# EAGLE design PocketKerbal (EAGLE 9.6.2)
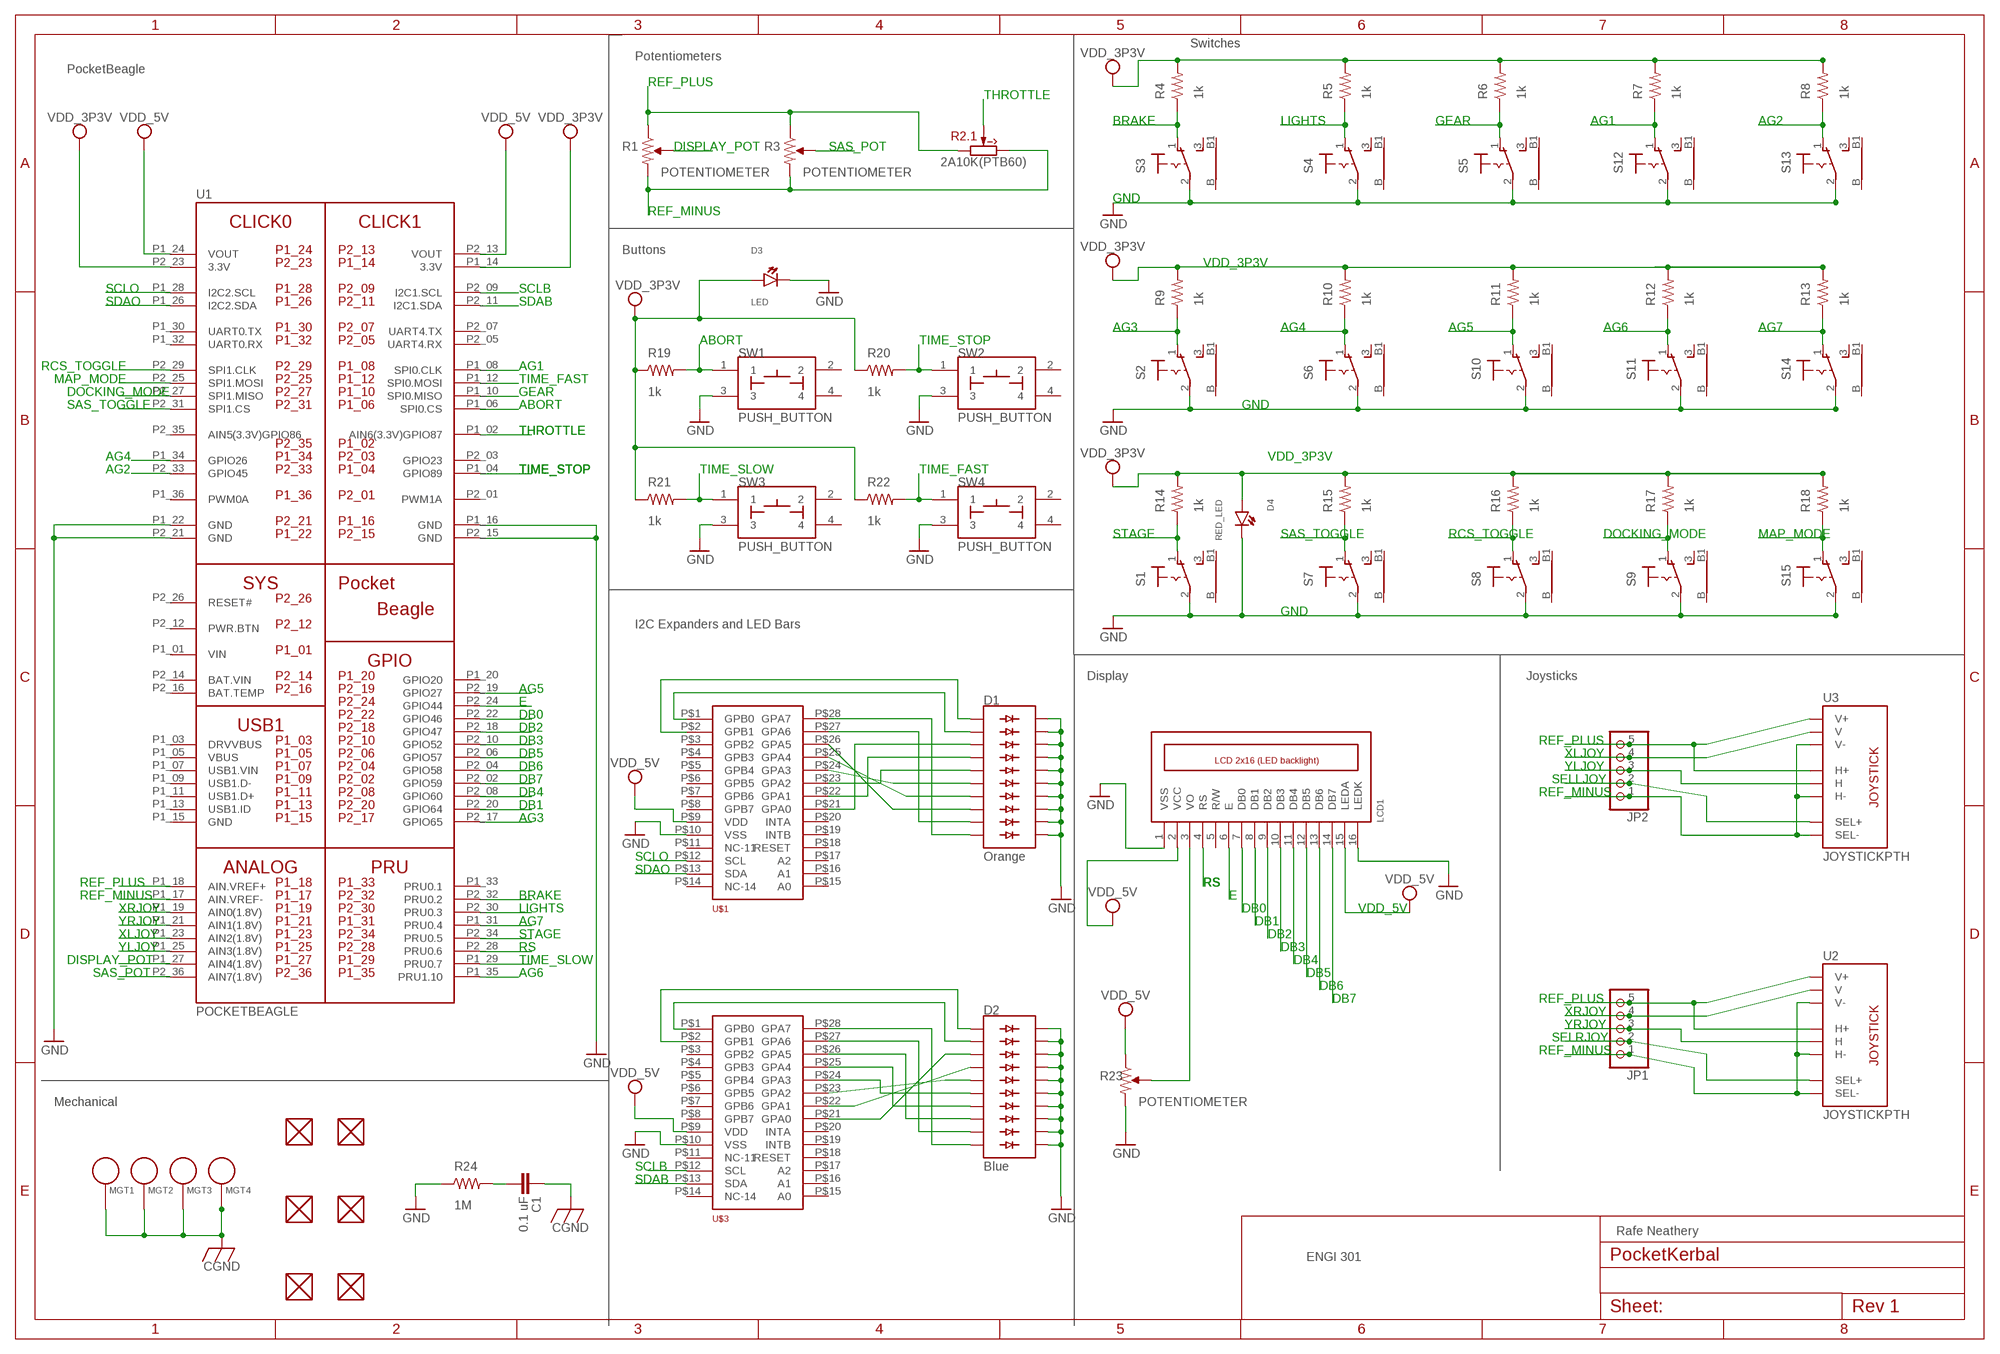
[diagram p0: schematic, sheet 1]

## Parts
C1  0.1 uF  C_C0402  [C0402]
D1  RED  LED_BARGRAPH_10RED  [LED_BARGRAPH_10]
D2  RED  LED_BARGRAPH_10RED  [LED_BARGRAPH_10]
D3  LED  [EIA-STD]
D4  RED_LED  LED  [EIA-STD]
FUD1  FIDUCIAL  [FIDUCIAL_40MIL]
FUD2  FIDUCIAL  [FIDUCIAL_40MIL]
FUD5  FIDUCIAL  [FIDUCIAL_40MIL]
FUD6  FIDUCIAL  [FIDUCIAL_40MIL]
FUD9  FIDUCIAL  [FIDUCIAL_40MIL]
FUD10  FIDUCIAL  [FIDUCIAL_40MIL]
JP1  PINHD-1X5  [1X05]
JP2  PINHD-1X5  [1X05]
LCD1  LCD_2X16_SIL  [HY-1602F]
MGT1  MOUNTING_HOLE  [MOUNTING_HOLE]
MGT2  MOUNTING_HOLE  [MOUNTING_HOLE]
MGT3  MOUNTING_HOLE  [MOUNTING_HOLE]
MGT4  MOUNTING_HOLE  [MOUNTING_HOLE]
R1  POTENTIOMETER  [POT-PO90S]
R2  2A10K(PTB60)  [PTB6044]
R3  POTENTIOMETER  [POT-PO90S]
R4  1k  R_R0603  [R0603]
R5  1k  R_R0603  [R0603]
R6  1k  R_R0603  [R0603]
R7  1k  R_R0603  [R0603]
R8  1k  R_R0603  [R0603]
R9  1k  R_R0603  [R0603]
R10  1k  R_R0603  [R0603]
R11  1k  R_R0603  [R0603]
R12  1k  R_R0603  [R0603]
R13  1k  R_R0603  [R0603]
R14  1k  R_R0603  [R0603]
R15  1k  R_R0603  [R0603]
R16  1k  R_R0603  [R0603]
R17  1k  R_R0603  [R0603]
R18  1k  R_R0603  [R0603]
R19  1k  R_R0603  [R0603]
R20  1k  R_R0603  [R0603]
R21  1k  R_R0603  [R0603]
R22  1k  R_R0603  [R0603]
R23  POTENTIOMETER  [POT-PO90S]
R24  1M  R_R0603  [R0603]
S1  9070-1W  [9070-1W]
S2  9070-1W  [9070-1W]
S3  9070-1W  [9070-1W]
S4  9070-1W  [9070-1W]
S5  9070-1W  [9070-1W]
S6  9070-1W  [9070-1W]
S7  9070-1W  [9070-1W]
S8  9070-1W  [9070-1W]
S9  9070-1W  [9070-1W]
S10  9070-1W  [9070-1W]
S11  9070-1W  [9070-1W]
S12  9070-1W  [9070-1W]
S13  9070-1W  [9070-1W]
S14  9070-1W  [9070-1W]
S15  9070-1W  [9070-1W]
SW1  PUSH_BUTTON  [BUTTON_12.5MM]
SW2  PUSH_BUTTON  [BUTTON_12.5MM]
SW3  PUSH_BUTTON  [BUTTON_12.5MM]
SW4  PUSH_BUTTON  [BUTTON_12.5MM]
U1  POCKETBEAGLE  [POCKETBEAGLE]
U2  JOYSTICKPTH  [JOYSTICK]
U3  JOYSTICKPTH  [JOYSTICK]
U$1  MCP23017-E/SP  [DIP28]
U$3  MCP23017-E/SP  [DIP28]

## Nets
ABORT: R19.2 SW1.1 U1.P1_06(SPI0.CS)
AG1: R7.1 S12.1(O) U1.P1_08(SPI0.CLK)
AG2: R8.1 S13.1(O) U1.P2_33(GPIO45)
AG3: R9.1 S2.1(O) U1.P2_17(GPIO65)
AG4: R10.1 S6.1(O) U1.P1_34(GPIO26)
AG5: R11.1 S10.1(O) U1.P2_19(GPIO27)
AG6: R12.1 S11.1(O) U1.P1_35(PRU1.10)
AG7: R13.1 S14.1(O) U1.P1_31(PRU0.4)
BRAKE: R4.1 S3.1(O) U1.P2_32(PRU0.2)
CGND: C1.1 MGT1.P$1 MGT2.P$1 MGT3.P$1 MGT4.P$1
DB0: LCD1.7(DB0) U1.P2_22(GPIO46)
DB1: LCD1.8(DB1) U1.P2_20(GPIO64)
DB2: LCD1.9(DB2) U1.P2_18(GPIO47)
DB3: LCD1.10(DB3) U1.P2_10(GPIO52)
DB4: LCD1.11(DB4) U1.P2_08(GPIO60)
DB5: LCD1.12(DB5) U1.P2_06(GPIO57)
DB6: LCD1.13(DB6) U1.P2_04(GPIO58)
DB7: LCD1.14(DB7) U1.P2_02(GPIO59)
DISPLAY_POT: R1.S U1.P1_27(AIN4(1.8V))
DOCKING_MODE: R17.1 S9.1(O) U1.P2_27(SPI1.MISO)
E: LCD1.6(E) U1.P2_24(GPIO44)
GEAR: R6.1 S5.1(O) U1.P1_10(SPI0.MISO)
GND: D1.11(C9) D1.12(C8) D1.13(C7) D1.14(C6) D1.15(C5) D1.16(C4) D1.17(C3) D1.18(C2) D1.19(C1) D1.20(C) D2.11(C9) D2.12(C8) D2.13(C7) D2.14(C6) D2.15(C5) D2.16(C4) D2.17(C3) D2.18(C2) D2.19(C1) D2.20(C) D3.CATHODE D4.CATHODE LCD1.1(VSS) LCD1.16(LEDK) R23.CW R24.1 S1.2(P) S2.2(P) S3.2(P) S4.2(P) S5.2(P) S6.2(P) S7.2(P) S8.2(P) S9.2(P) S10.2(P) S11.2(P) S12.2(P) S13.2(P) S14.2(P) S15.2(P) SW1.3 SW2.3 SW3.3 SW4.3 U1.P1_16(GND) U1.P1_22(GND) U1.P2_15(GND) U1.P2_21(GND) U$1.P$10(VSS) U$3.P$10(VSS)
LIGHTS: R5.1 S4.1(O) U1.P2_30(PRU0.3)
MAP_MODE: R18.1 S15.1(O) U1.P2_25(SPI1.MOSI)
N$1: D2.3(A2) U$3.P$21(GPA0)
N$2: D2.4(A3) U$3.P$22(GPA1)
N$3: D2.10(A9) U$3.P$28(GPA7)
N$4: D2.9(A8) U$3.P$27(GPA6)
N$5: D2.8(A7) U$3.P$26(GPA5)
N$6: D2.7(A6) U$3.P$25(GPA4)
N$7: D2.6(A5) U$3.P$24(GPA3)
N$8: D2.5(A4) U$3.P$23(GPA2)
N$9: D2.2(A1) U$3.P$1(GPB0)
N$10: D1.3(A2) U$1.P$21(GPA0)
N$11: LCD1.3(VO) R23.S
N$12: D1.6(A5) U$1.P$24(GPA3)
N$13: D1.7(A6) U$1.P$25(GPA4)
N$14: D1.8(A7) U$1.P$26(GPA5)
N$15: D1.9(A8) U$1.P$27(GPA6)
N$20: D1.10(A9) U$1.P$28(GPA7)
N$21: D1.2(A1) U$1.P$1(GPB0)
N$22: D1.1(A) U$1.P$2(GPB1)
N$23: D2.1(A) U$3.P$2(GPB1)
N$26: C1.2 R24.2
N$28: D1.5(A4) U$1.P$23(GPA2)
N$29: D1.4(A3) U$1.P$22(GPA1)
RCS_TOGGLE: R16.1 S8.1(O) U1.P2_29(SPI1.CLK)
REF_MINUS: JP1.1 JP2.1 R1.CW R2.A3(.1:CW) R3.CW U1.P1_17(AIN.VREF-) U2.B2A(SEL-) U2.H3(H-) U2.V3(V-) U3.B2A(SEL-) U3.H3(H-) U3.V3(V-)
REF_PLUS: JP1.5 JP2.5 R1.CCW R2.A1(.1:CCW) R3.CCW U1.P1_18(AIN.VREF+) U2.H1(H+) U2.V1(V+) U3.H1(H+) U3.V1(V+)
RS: LCD1.4(RS) U1.P2_28(PRU0.6)
SAS_POT: R3.S U1.P2_36(AIN7(1.8V))
SAS_TOGGLE: R15.1 S7.1(O) U1.P2_31(SPI1.CS)
SCLB: U1.P2_09(I2C1.SCL) U$3.P$12(SCL)
SCLO: U1.P1_28(I2C2.SCL) U$1.P$12(SCL)
SDAB: U1.P2_11(I2C1.SDA) U$3.P$13(SDA)
SDAO: U1.P1_26(I2C2.SDA) U$1.P$13(SDA)
SELLJOY: JP2.2 U3.B1A(SEL+)
SELRJOY: JP1.2 U2.B1A(SEL+)
STAGE: R14.1 S1.1(O) U1.P2_34(PRU0.5)
THROTTLE: R2.A2(.1:W) U1.P1_02(AIN6(3.3V)GPIO87)
TIME_FAST: R22.2 SW4.1 U1.P1_12(SPI0.MOSI)
TIME_SLOW: R21.2 SW3.1 U1.P1_29(PRU0.7)
TIME_STOP: R20.2 SW2.1 U1.P1_04(GPIO89)
VDD_3P3V: D3.ANODE D4.ANODE R4.2 R5.2 R6.2 R7.2 R8.2 R9.2 R10.2 R11.2 R12.2 R13.2 R14.2 R15.2 R16.2 R17.2 R18.2 R19.1 R20.1 R21.1 R22.1 U1.P1_14(3.3V) U1.P2_23(3.3V)
VDD_5V: LCD1.2(VCC) LCD1.15(LEDA) R23.CCW U1.P1_24(VOUT) U1.P2_13(VOUT) U$1.P$9(VDD) U$3.P$9(VDD)
XLJOY: JP2.4 U1.P1_23(AIN2(1.8V)) U3.V2(V)
XRJOY: JP1.4 U1.P1_19(AIN0(1.8V)) U2.V2(V)
YLJOY: JP2.3 U1.P1_25(AIN3(1.8V)) U3.H2(H)
YRJOY: JP1.3 U1.P1_21(AIN1(1.8V)) U2.H2(H)
Unconnected: FUD1.P$1 FUD2.P$1 FUD5.P$1 FUD6.P$1 FUD9.P$1 FUD10.P$1 LCD1.5(R/W) R2.B1(.2:CCW) R2.B2(.2:W) R2.B3(.2:CW) S1.3(S) S1.B S1.B1 S2.3(S) S2.B S2.B1 S3.3(S) S3.B S3.B1 S4.3(S) S4.B S4.B1 S5.3(S) S5.B S5.B1 S6.3(S) S6.B S6.B1 S7.3(S) S7.B S7.B1 S8.3(S) S8.B S8.B1 S9.3(S) S9.B S9.B1 S10.3(S) S10.B S10.B1 S11.3(S) S11.B S11.B1 S12.3(S) S12.B S12.B1 S13.3(S) S13.B S13.B1 S14.3(S) S14.B S14.B1 S15.3(S) S15.B S15.B1 SW1.2 SW1.4 SW2.2 SW2.4 SW3.2 SW3.4 SW4.2 SW4.4 U1.P1_03(DRVVBUS) U1.P1_05(VBUS) U1.P1_07(USB1.VIN) U1.P1_09(USB1.D-) U1.P1_11(USB1.D+) U1.P1_13(USB1.ID) U1.P1_15(GND) U1.P1_20(GPIO20) U1.P1_30(UART0.TX) U1.P1_32(UART0.RX) U1.P1_33(PRU0.1) U1.P1_36(PWM0A) U1.P2_01(PWM1A) U1.P2_03(GPIO23) U1.P2_05(UART4.RX) U1.P2_07(UART4.TX) U1.P2_12(PWR.BTN) U1.P2_16(BAT.TEMP) U1.P2_26(RESET#) U1.P2_35(AIN5(3.3V)GPIO86) U$1.P$3(GPB2) U$1.P$4(GPB3) U$1.P$5(GPB4) U$1.P$6(GPB5) U$1.P$7(GPB6) U$1.P$8(GPB7) U$1.P$11(NC-11) U$1.P$14(NC-14) U$1.P$15(A0) U$1.P$16(A1) U$1.P$17(A2) U$1.P$18(RESET) U$1.P$19(INTB) U$1.P$20(INTA) U$3.P$3(GPB2) U$3.P$4(GPB3) U$3.P$5(GPB4) U$3.P$6(GPB5) U$3.P$7(GPB6) U$3.P$8(GPB7) U$3.P$11(NC-11) U$3.P$14(NC-14) U$3.P$15(A0) U$3.P$16(A1) U$3.P$17(A2) U$3.P$18(RESET) U$3.P$19(INTB) U$3.P$20(INTA)

## Notes on the sheet
- Switches
- Potentiometers
- PocketBeagle
- Buttons
- I2C Expanders and LED Bars
- Display | Joysticks
- Orange
- Mechanical
- Blue
- Rafe Neathery
- ENGI 301

## Power pins joined to a net without a drawn wire
BAT.VIN: U1.P2_14(BAT.VIN)
VIN: U1.P1_01(VIN)

## Library data of the parts
C1 = combo_lock:C_: Capacitor SMD. Sizes: 0402, 0603 & 0805
D1 D2 = SparkFun-LED:LED_BARGRAPH_10: Young Sun LED Tech - YSLB-10251G5-10 10-Segment LED Bar Graph Features: Red Vf = 2.1V, Ifmax = 20mA Yellow Vf = 2.1V, Ifmax = 20mA Blue Vf = 3.4V, Ifmax = 20mA Green Vf = 3.4V, Ifmax = 20mA SparkFun Products: Red <https://www.sparkfun.com/products/9935> Yellow <https://www.sparkfun.com/products/9936> Green <https://www.sparkfun.com/products/9938> Blue <https://www.sparkfun.com/products/9937>; PROD_ID: DIO-10615
D3 D4 = combo_lock:LED: EIA-STD LED, LTST-C191TBKT
FUD1 FUD2 FUD5 FUD6 FUD9 FUD10 = combo_lock:FIDUCIAL
JP1 JP2 = pinhead:PINHD-1X5: PIN HEADER
LCD1 = lcd_2x16_led_backlight:LCD_2X16_SIL
MGT1-MGT4 = combo_lock:MOUNTING_HOLE: Chassis Mounting Hole w/GND connection ability
R1 R3 R23 = combo_lock:POTENTIOMETER: Potentiometer - Examples: P090S-14T20BR10K (987-1277-ND)
R2 = potentiometers:2**?(PTB60)
R4-R22 R24 = combo_lock:R_: RESISTOR, American symbol
S1-S15 = switch:9070-1W: TOGGLE SWITCH Marquardt
SW1-SW4 = combo_lock:PUSH_BUTTON
U1 = combo_lock:POCKETBEAGLE
U2 U3 = adafruit:JOYSTICK: Thumb Joystick Joystick commonly found in PS2 controllers. Two pots and a select switch. Adapted from Sparkfun Library (but for more common 6mm switch sticks)
U$1 U$3 = IO-Expanders:MCP23017-E/SP: MCP23017 16 pin IO Expander using I2C bus; MCP23017-ESP: DIP

## Board
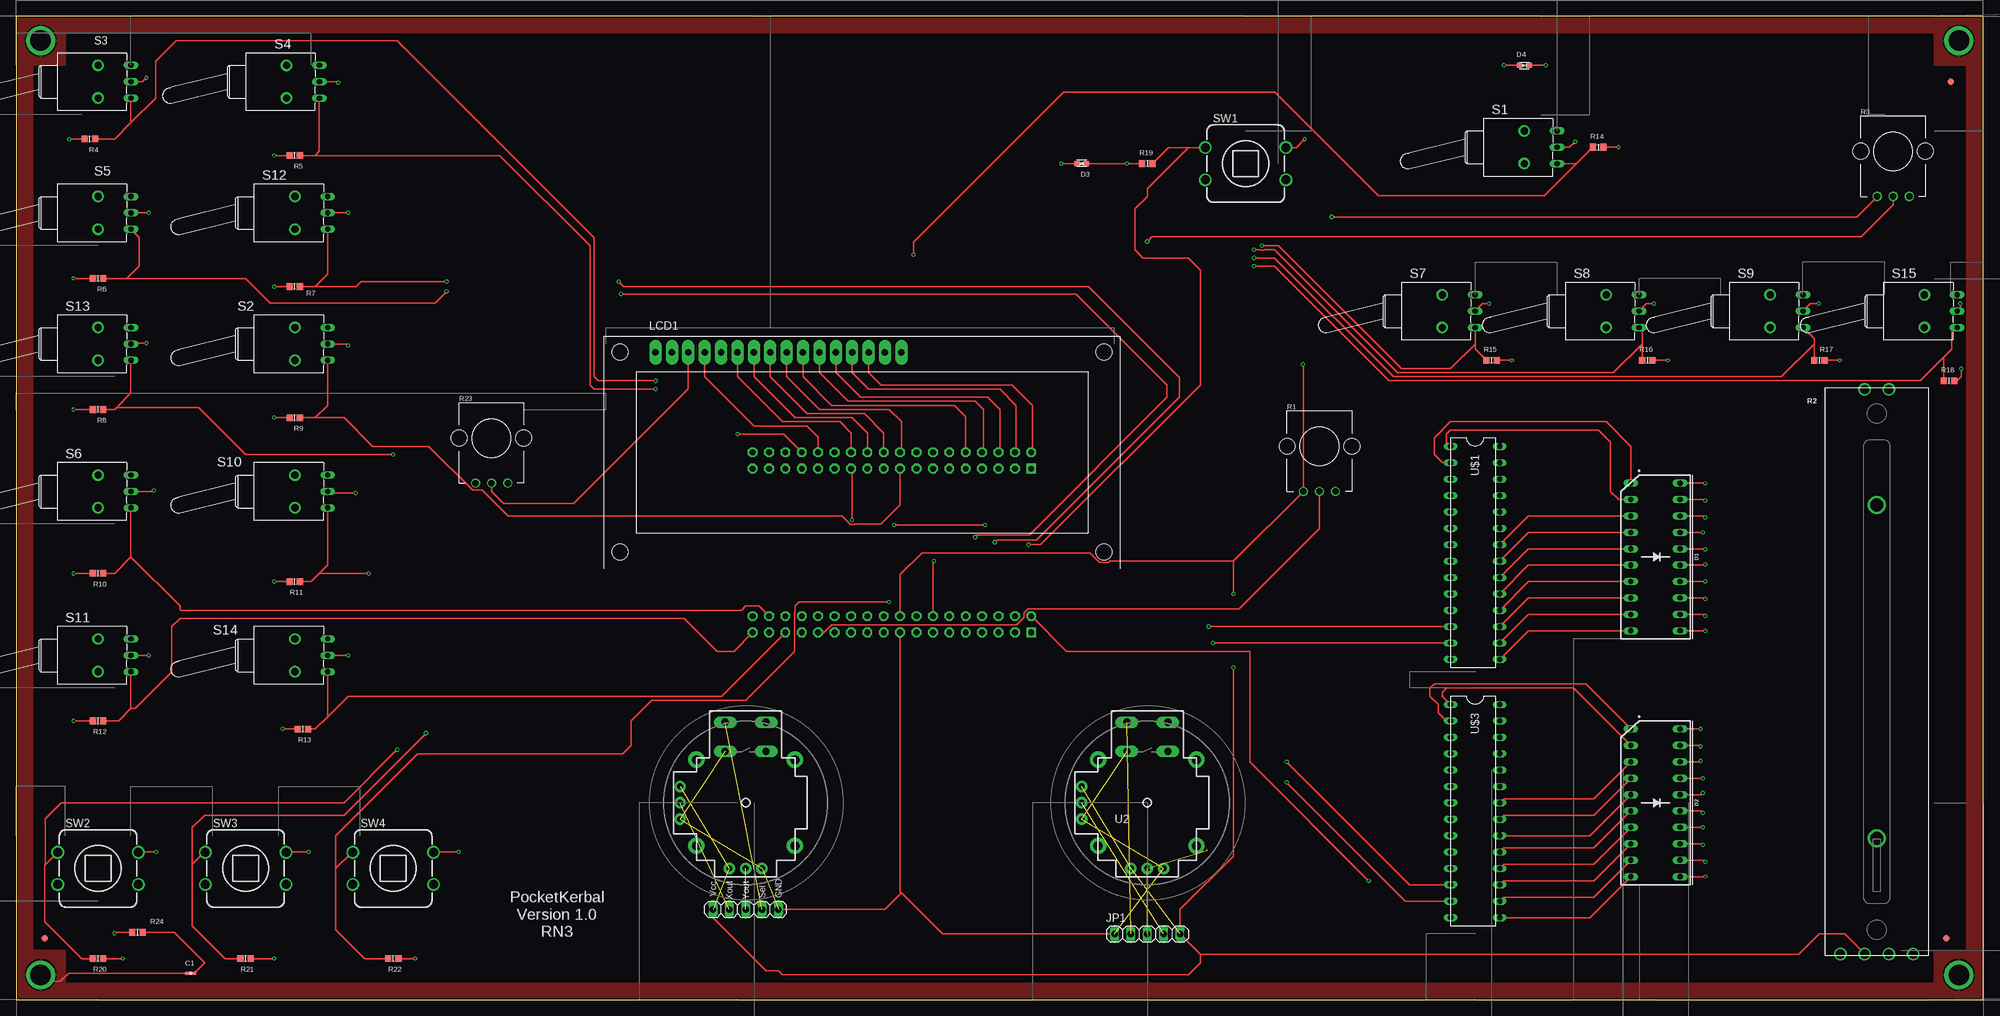
[diagram p1: board, top side]
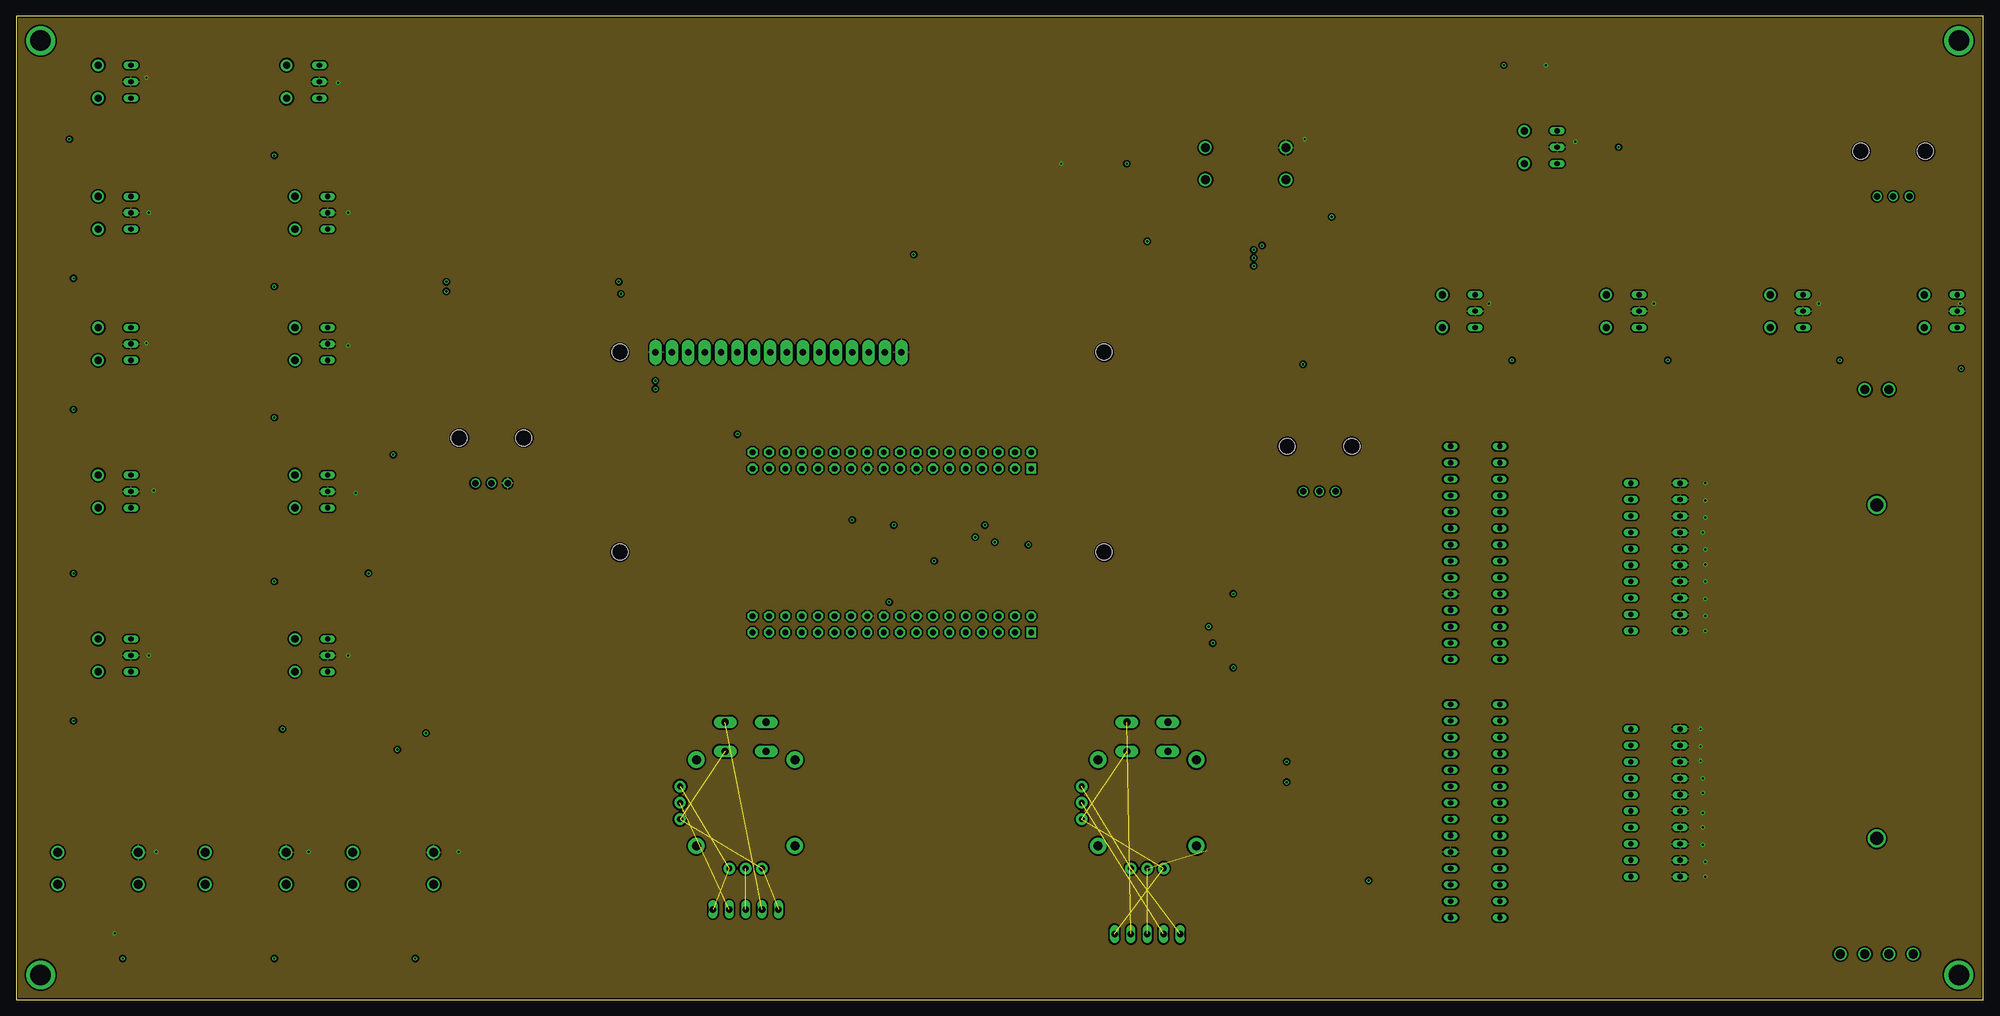
[diagram p2: board, inner layer Route2]
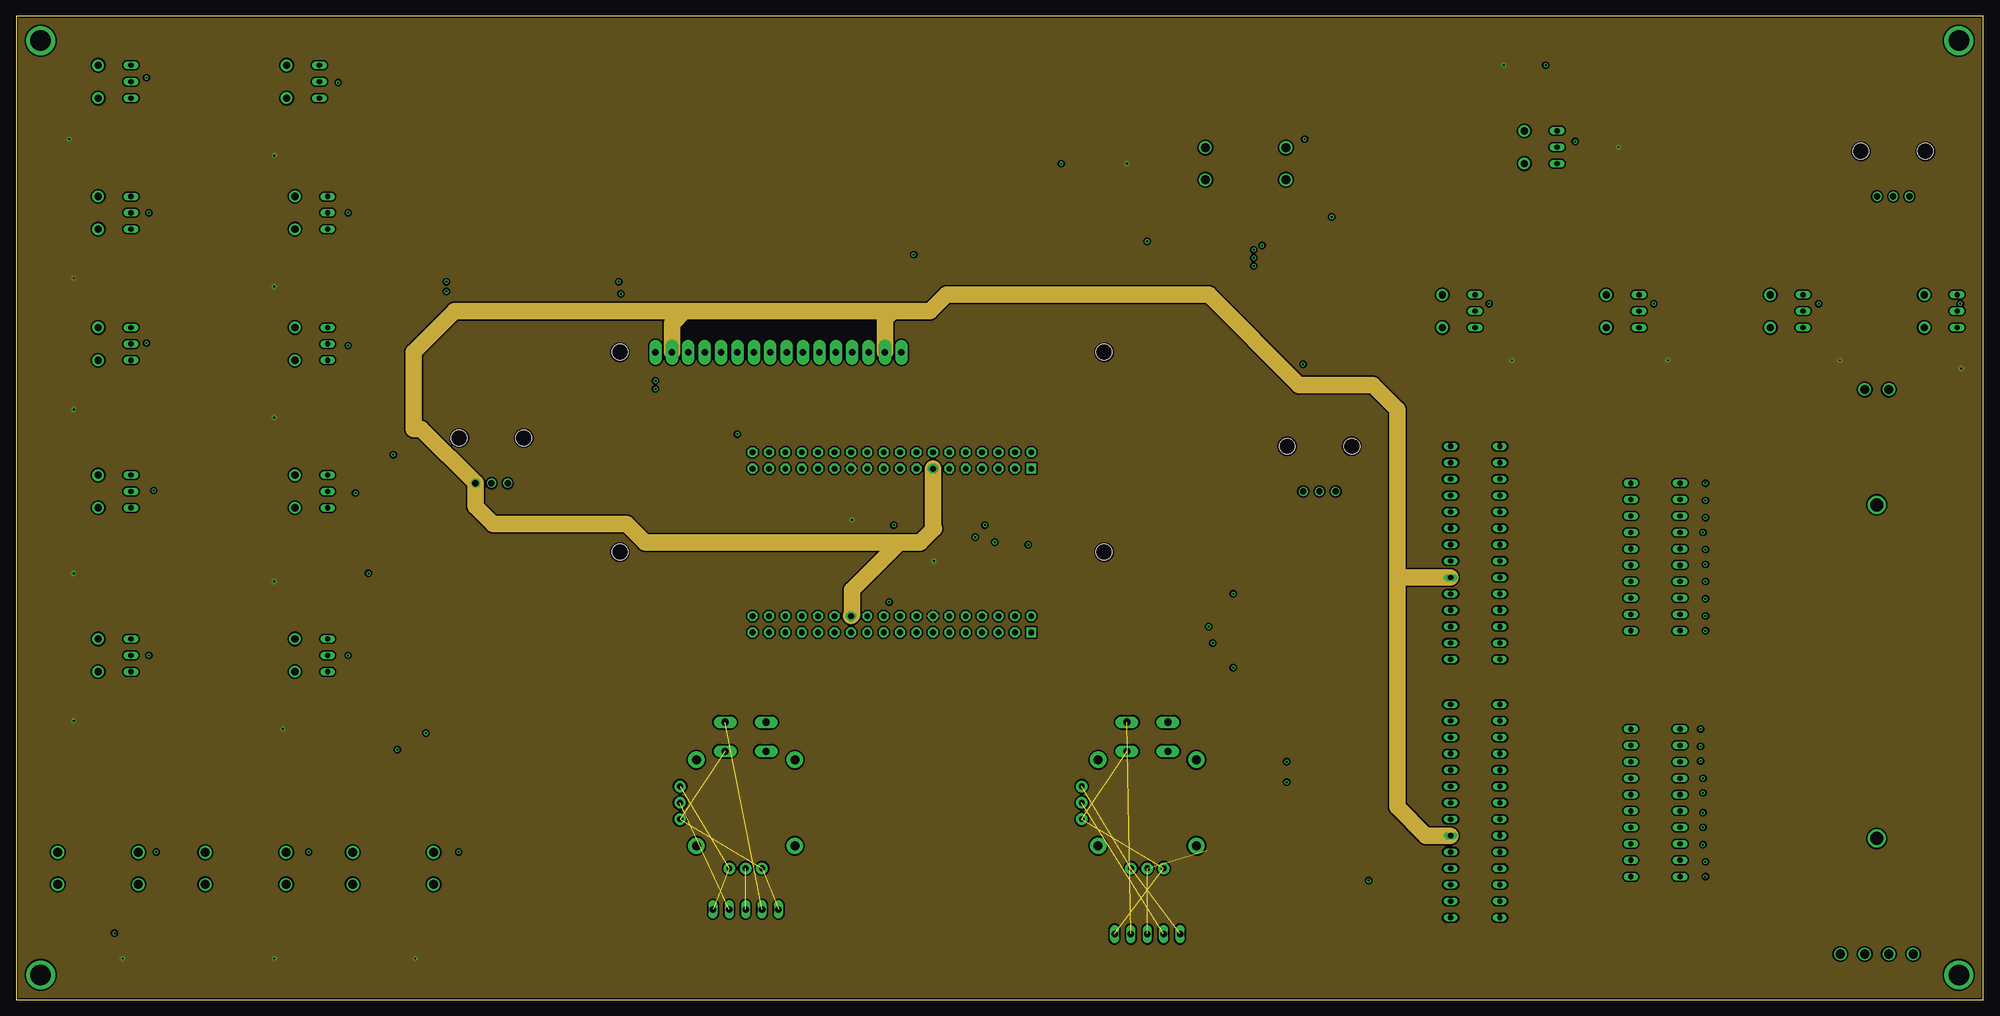
[diagram p3: board, inner layer Route15]
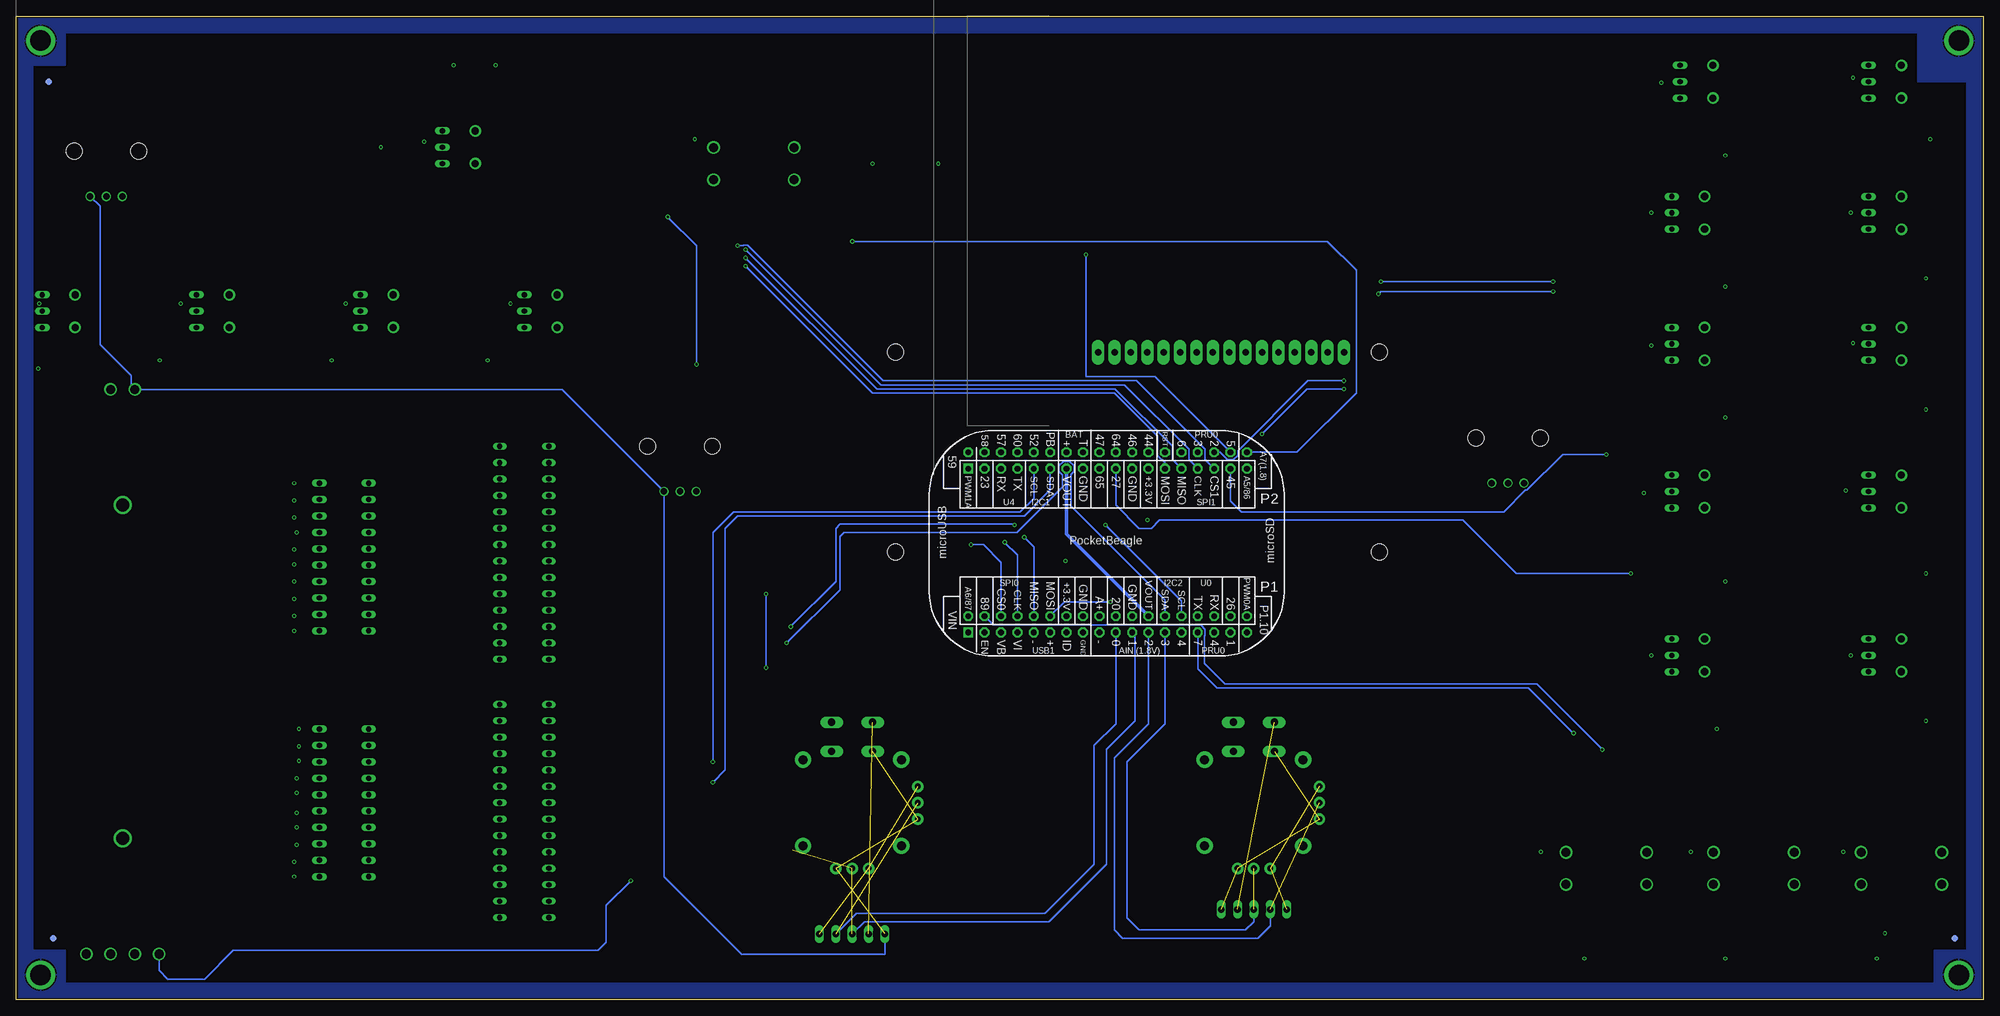
[diagram p4: board, bottom side, seen from below]

Size 304.8 x 152.4 mm. Coordinates in mm from the lower left corner, seen from the top.
Outline: 0,0 304.8,0 304.8,152.4 0,152.4 0,0
Copper layers (1*2*15*16): Top 0.035mm / dielectric 0.23mm / Route2 0.035mm / dielectric 0.93mm / Route15 0.035mm / dielectric 0.23mm / Bottom 0.035mm
Design rules "ENGI301_4lyr": minimum track width 10mil, minimum drill 12mil, track to track 10mil, track to pad 10mil, pad to pad 10mil, via to via 10mil, smd to smd 10mil, copper to edge 10mil, drill to drill 12mil, minimum pad ring 6mil, minimum via ring 6mil, stop-mask expansion 3mil, vias tented up to drill 25mil, thermal gap 10mil

### Footprints (pad centres in the part's own frame; a part is rotated, then mirrored left to right if it is on the bottom)
C0402 = smd 0.61 x 0.508: 1 -0.559,0; 2 0.559,0
LED_BARGRAPH_10 = drill 0.813 long: 1 -11.43,-3.81; 2 -8.89,-3.81; 3 -6.35,-3.81; 4 -3.81,-3.81; 5 -1.27,-3.81; 6 1.27,-3.81; 7 3.81,-3.81; 8 6.35,-3.81; 9 8.89,-3.81; 10 11.43,-3.81; 11 11.43,3.81; 12 8.89,3.81; 13 6.35,3.81; 14 3.81,3.81; 15 1.27,3.81; 16 -1.27,3.81; 17 -3.81,3.81; 18 -6.35,3.81; 19 -8.89,3.81; 20 -11.43,3.81
EIA-STD = smd 0.8 x 0.8: ANODE -0.75,0; CATHODE 0.75,0
FIDUCIAL_40MIL = smd 1.016 x 1.016: P$1 0,0
1X05 = drill 1.016 long: 1 -5.08,0; 2 -2.54,0; 3 0,0; 4 2.54,0; 5 5.08,0
HY-1602F = drill 1 pad 1.93 long: 1 2.54,0; 2 5.08,0; 3 7.62,0; 4 10.16,0; 5 12.7,0; 6 15.24,0; 7 17.78,0; 8 20.32,0; 9 22.86,0; 10 25.4,0; 11 27.94,0; 12 30.48,0; 13 33.02,0; 14 35.56,0; 15 38.1,0; 16 40.64,0 | hole 2.5: -2.96,0; 72.04,0; -2.96,-31; 72.04,-31
MOUNTING_HOLE = drill 3.175 pad 4.445: P$1 0,0
POT-PO90S = drill 1: CCW -2.5,0; CW 2.5,0; S 0,0 | hole 2.5: -5,7; 5,7
PTB6044 = drill 1.4: A1 -1.875,-43.75; A2 -5.625,-43.75; A3 -1.875,43.75; B1 1.875,-43.75; B2 5.625,-43.75; B3 1.875,43.75 | drill 2: S$1 0,-25.85; S$2 0,25.85
R0603 = smd 0.95 x 1.031: 1 -0.8,0; 2 0.8,0
9070-1W = drill 0.813 long: 1 5.08,-2.54; 2 5.08,0; 3 5.08,2.54 | drill 1.118 pad 1.778: B 0,-2.54; B1 0,2.54
BUTTON_12.5MM = drill 1.4: 1 -6.25,2.5; 2 -6.25,-2.5; 3 6.25,2.5; 4 6.25,-2.5
POCKETBEAGLE = drill 0.889 pad 1.524 square: P1_01 5.91,3.53; P2_01 5.91,28.93 | drill 0.889 pad 1.524 octagon: P1_02 5.91,6.07; P1_03 8.45,3.53; P1_04 8.45,6.07; P1_05 10.99,3.53; P1_06 10.99,6.07; P1_07 13.53,3.53; P1_08 13.53,6.07; P1_09 16.07,3.53; P1_10 16.07,6.07; P1_11 18.61,3.53; P1_12 18.61,6.07; P1_13 21.15,3.53; P1_14 21.15,6.07; P1_15 23.69,3.53; P1_16 23.69,6.07; P1_17 26.23,3.53; P1_18 26.23,6.07; P1_19 28.77,3.53; P1_20 28.77,6.07; P1_21 31.31,3.53; P1_22 31.31,6.07; P1_23 33.85,3.53; P1_24 33.85,6.07; P1_25 36.39,3.53; P1_26 36.39,6.07; P1_27 38.93,3.53; P1_28 38.93,6.07; P1_29 41.47,3.53; P1_30 41.47,6.07; P1_31 44.01,3.53; P1_32 44.01,6.07; P1_33 46.55,3.53; P1_34 46.55,6.07; P1_35 49.09,3.53; P1_36 49.09,6.07; P2_02 5.91,31.47; P2_03 8.45,28.93; P2_04 8.45,31.47; P2_05 10.99,28.93; P2_06 10.99,31.47; P2_07 13.53,28.93; P2_08 13.53,31.47; P2_09 16.07,28.93; P2_10 16.07,31.47; P2_11 18.61,28.93; P2_12 18.61,31.47; P2_13 21.15,28.93; P2_14 21.15,31.47; P2_15 23.69,28.93; P2_16 23.69,31.47; P2_17 26.23,28.93; P2_18 26.23,31.47; P2_19 28.77,28.93; P2_20 28.77,31.47; P2_21 31.31,28.93; P2_22 31.31,31.47; P2_23 33.85,28.93; P2_24 33.85,31.47; P2_25 36.39,28.93; P2_26 36.39,31.47; P2_27 38.93,28.93; P2_28 38.93,31.47; P2_29 41.47,28.93; P2_30 41.47,31.47; P2_31 44.01,28.93; P2_32 44.01,31.47; P2_33 46.55,28.93; P2_34 46.55,31.47; P2_35 49.09,28.93; P2_36 49.09,31.47
JOYSTICK = drill 1.1 pad 1.778 long: B1A -3.175,12.501; B1B 3.175,12.501; B2A -3.175,8.001; B2B 3.175,8.001 | drill 0.889 pad 1.778: H1 -2.54,-10.16; H2 0,-10.16; H3 2.54,-10.16; V1 -10.16,2.54; V2 -10.16,0; V3 -10.16,-2.54 | drill 1.397 pad 2.54: MOUNT1 -7.62,6.668; MOUNT2 -7.62,-6.668; MOUNT3 7.62,-6.668; MOUNT4 7.62,6.668
DIP28 = drill 0.8 long: P$1 0,0; P$2 2.54,0; P$3 5.08,0; P$4 7.62,0; P$5 10.16,0; P$6 12.7,0; P$7 15.24,0; P$8 17.78,0; P$9 20.32,0; P$10 22.86,0; P$11 25.4,0; P$12 27.94,0; P$13 30.48,0; P$14 33.02,0; P$15 0,7.62; P$16 2.54,7.62; P$17 5.08,7.62; P$18 7.62,7.62; P$19 10.16,7.62; P$20 12.7,7.62; P$21 15.24,7.62; P$22 17.78,7.62; P$23 20.32,7.62; P$24 22.86,7.62; P$25 25.4,7.62; P$26 27.94,7.62; P$27 30.48,7.62; P$28 33.02,7.62

### Placement (x,y rotation side)
C1  27.05,4.06 0 top
D1  254,68.58 270 top
D2  254,30.48 270 top
D3  165.1,129.54 180 top
D4  233.68,144.78 0 top
FUD1  4.45,9.53 0 top
FUD2  299.08,9.53 0 top
FUD5  299.72,142.24 0 top
FUD6  299.72,142.24 0 bottom
FUD9  299.08,9.53 0 bottom
FUD10  4.45,9.53 0 bottom
JP1  175.26,10.16 0 top
JP2  113.03,13.97 180 top
LCD1  96.52,100.33 0 top
MGT1  3.81,3.81 0 top
MGT2  3.81,148.59 0 top
MGT3  300.99,148.59 0 top
MGT4  300.99,3.81 0 top
R1  201.93,78.74 0 top
R2  2*A10K(PTB60)  [PTB6044]  288.29,50.8 0 top
R3  290.83,124.46 0 top
R4  11.43,133.35 180 top
R5  43.18,130.81 180 top
R6  12.7,111.76 180 top
R7  43.18,110.49 180 top
R8  12.7,91.44 180 top
R9  43.18,90.17 180 top
R10  12.7,66.04 180 top
R11  43.18,64.77 180 top
R12  12.7,43.18 180 top
R13  44.45,41.91 180 top
R14  245.11,132.08 0 top
R15  228.6,99.06 0 top
R16  252.73,99.06 0 top
R17  279.4,99.06 0 top
R18  299.47,95.89 0 top
R19  175.26,129.54 0 top
R20  12.7,6.35 180 top
R21  35.56,6.35 180 top
R22  58.42,6.35 180 top
R23  73.66,80.01 0 top
R24  18.8,10.41 0 top
S1  233.68,132.08 0 top
S2  43.18,101.6 0 top
S3  12.7,142.24 0 top
S4  41.91,142.24 0 top
S5  12.7,121.92 0 top
S6  12.7,78.74 0 top
S7  220.98,106.68 0 top
S8  246.38,106.68 0 top
S9  271.78,106.68 0 top
S10  43.18,78.74 0 top
S11  12.7,53.34 0 top
S12  43.18,121.92 0 top
S13  12.7,101.6 0 top
S14  43.18,53.34 0 top
S15  295.66,106.68 0 top
SW1  190.5,129.54 0 top
SW2  12.7,20.32 0 top
SW3  35.56,20.32 0 top
SW4  58.42,20.32 0 top
U1  163.19,53.34 0 bottom
U2  175.26,30.48 0 top
U3  113.03,30.48 0 top
U$1  222.25,85.72 270 top
U$3  222.25,45.72 270 top

### Tracks (layer width: path | path; a pad name or v marks a point on that pad's centre or on a via)
ABORT  (via drill 0.35)
  Top 0.254: R19.2 178.56,132.04 181.61,132.04 | 181.61,132.04 SW1.1 | 181.61,132.04 175.26,125.69 175.26,124.46 173.35,122.56 173.35,116.84 173.35,116.2 174.62,114.94 181.61,114.94 183.51,113.03 183.51,95.25 158.75,70.48 v156.84,70.48
  Bottom 0.254: v156.84,70.48 154.94,70.48 152.21,67.75 U1.P1_06
AG1  (via drill 0.35)
  Top 0.254: R7.1 46.35,110.49 | 46.35,110.49 48.26,112.39 S12.1 | 46.35,110.49 52.7,110.49 53.47,111.25 v66.67,111.25 | v151.64,70.87 152.02,71.25 158.12,71.25 180.21,93.34 180.21,96.39 166.12,110.49 94.11,110.49 v93.34,111.25
  Bottom 0.254: U1.P1_08 149.66,68.89 v151.64,70.87 | v93.34,111.25 v66.67,111.25
AG2  (via drill 0.35)
  Top 0.254: R8.1 15.24,91.44 15.56,91.76 | 15.56,91.76 17.78,93.98 S13.1 | 15.56,91.76 28.26,91.76 35.56,84.45 v58.42,84.45
  Bottom 0.254: v58.42,84.45 65.19,84.45 70.71,78.93 70.93,78.93 74.3,75.56 114.94,75.56 116.64,77.28 U1.P2_33
AG3
  Top 0.254: R9.1 46.35,90.17 | 46.35,90.17 48.26,92.08 S2.1 | 46.35,90.17 50.8,90.17 55.24,85.72 63.92,85.72 70.71,78.93 72.2,78.93 76.2,74.93 127.94,74.93 129.26,73.61 129.82,73.61 129.88,73.66 133.99,73.66 136.97,76.64 U1.P2_17
AG4
  Top 0.254: R10.1 15.24,66.04 17.78,68.58 | 17.78,68.58 S6.1 | 17.78,68.58 25.4,60.96 25.4,60.33 112.39,60.33 113.03,60.96 115.09,60.96 U1.P1_34
AG5  (via drill 0.35)
  Top 0.254: R11.1 45.72,64.77 46.99,66.04 | 46.99,66.04 48.26,67.31 S10.1 | 46.99,66.04 v54.61,66.04
  Bottom 0.254: U1.P2_19 134.43,76.64 130.81,73.03 128.91,73.03 127.64,74.3 80.64,74.3 72.39,66.04 v54.61,66.04
AG6
  Top 0.254: R12.1 15.88,43.18 17.78,45.09 | S11.1 17.78,45.09 | 17.78,45.09 18.41,45.09 24.13,50.8 24.13,57.78 25.4,59.05 103.5,59.05 108.58,53.98 111.21,53.98 U1.P1_35
AG7
  Top 0.254: R13.1 46.35,41.91 48.26,43.81 | 48.26,43.81 S14.1 | 48.26,43.81 51.44,46.99 109.31,46.99 U1.P1_31
BRAKE  (via drill 0.35)
  Top 0.254: R4.1 15.24,133.35 17.78,135.89 | 17.78,135.89 S3.1 | 17.78,135.89 21.59,139.7 21.59,145.41 24.77,148.59 59.05,148.59 89.53,118.11 89.53,96.52 90.17,95.89 v99.06,95.89
  Bottom 0.254: v99.06,95.89 104.65,95.89 115.5,85.03 115.5,84.34 116.17,83.67 117.12,83.67 118.26,84.81 U1.P2_32
CGND
  Top 0.254: C1.1 8.13,4.06 6.86,2.79 4.83,2.79 MGT1.P$1
  pour Top: -2.54,83.82 2.54,83.82 2.54,7.62 7.62,7.62 7.62,2.54 297.18,2.54 297.18,7.62 302.26,7.62 302.26,76.2 307.34,76.2 307.34,-2.54 -2.54,-2.54
  pour Top: 2.54,83.82 2.54,144.78 7.62,144.78 7.62,149.86 119.38,149.86 294.64,149.86 297.18,149.86 297.18,144.78 302.26,144.78 302.26,76.2 307.34,76.2 307.34,154.94 -2.54,154.94 -2.54,83.82
  pour Bottom: -2.54,154.94 307.34,154.94 307.34,78.74 302.26,78.74 302.26,144.78 297.18,144.78 297.18,149.86 10.16,149.86 10.16,142.24 2.54,142.24 2.54,73.66 -2.54,73.66
  pour Bottom: -2.54,73.66 -2.54,-2.54 307.34,-2.54 307.34,78.74 302.26,78.74 302.26,7.62 297.18,7.62 297.18,2.54 7.62,2.54 7.62,7.62 2.54,7.62 2.54,73.66
DB0
  Top 0.254: LCD1.7 114.3,96.52 120.65,90.17 129.54,90.17 131.88,87.83 U1.P2_22
DB1
  Top 0.254: LCD1.8 116.84,96.52 122.56,90.81 131.44,90.81 134.43,87.83 U1.P2_20
DB2
  Top 0.254: LCD1.9 119.38,96.52 124.46,91.44 135.25,91.44 137.16,89.53 137.16,85 U1.P2_18
DB3
  Top 0.254: LCD1.10 121.92,96.52 126.36,92.08 145.41,92.08 147.12,90.36 U1.P2_10
DB4
  Top 0.254: LCD1.11 124.46,97.16 128.91,92.71 148.59,92.71 149.86,91.44 149.86,85 U1.P2_08
DB5
  Top 0.254: LCD1.12 127,97.16 130.81,93.34 150.5,93.34 152.4,91.44 152.4,85 U1.P2_06
DB6
  Top 0.254: LCD1.13 129.54,97.16 132.08,94.61 152.4,94.61 154.94,92.08 154.94,85 U1.P2_04
DB7
  Top 0.254: LCD1.14 132.08,97.16 133.99,95.25 154.31,95.25 157.48,92.08 157.48,85 U1.P2_02
DISPLAY_POT
  Top 0.254: R1.S 201.93,73.03 189.46,60.55 156.81,60.55 156.14,59.88 156.14,59.19 154.96,58.01 126.33,58.01 125.19,56.87 U1.P1_27
DOCKING_MODE  (via drill 0.35)
  Top 0.254: R17.1 278.6,101.6 | 278.6,101.6 278.6,102.4 S9.1 | 278.6,101.6 273.52,96.52 213.36,96.52 194.94,114.94 v191.77,114.94
  Bottom 0.254: v191.77,114.94 171.45,94.61 134.54,94.61 125.66,85.74 125.66,83.67 U1.P2_27
E
  Top 0.254: LCD1.6 111.76,96.52 118.75,89.53 127.64,89.53 129.34,87.83 U1.P2_24
GEAR  (via drill 0.35)
  Top 0.254: R6.1 17.14,111.76 | S5.1 19.05,118.11 19.05,113.67 17.14,111.76 | 17.14,111.76 35.56,111.76 39.37,107.95 64.9,107.95 v66.67,109.73 | v93.73,109.35 164.21,109.35 178.31,95.25 178.31,93.34 156.97,72.01 148.97,72.01 v148.59,71.63
  Bottom 0.254: v66.67,109.73 93.34,109.73 v93.73,109.35 | v148.59,71.63 147.12,70.16 U1.P1_10
GND  (via drill 0.3 pad 0.61)
  Top 0.254: SW4.3 64.71,22.86 v68.58,22.86 | R24.1 15.37,10.41 v15.24,10.29 | SW3.3 41.85,22.86 v45.34,22.86 | SW2.3 18.99,22.86 v21.72,22.86 | S11.2 v20.57,53.34 | S14.2 v51.44,53.34 | S6.2 21.21,78.74 v21.34,78.87 | S10.2 48.51,78.49 v52.58,78.49 | S13.2 17.91,101.73 v20.19,101.73 | S2.2 51.18,101.6 v51.44,101.35 | S5.2 v20.57,121.92 | S12.2 v51.44,121.92 | S3.2 19.56,142.24 v20.19,142.88 | S4.2 49.78,142.24 v49.91,142.11 | D3.CATHODE v161.93,129.54 | SW1.3 198.33,132.04 v199.64,133.35 | D4.CATHODE v236.98,144.78 | S1.2 240.66,132.08 v241.55,132.97 | S15.2 301.24,107.19 v301.24,107.82 | S9.2 278,107.82 v279.27,107.82 | S8.2 252.6,107.82 v253.75,107.82 | S7.2 227.2,107.82 v228.22,107.82 | D1.20 v261.75,80.01 | D1.19 261.62,77.47 v261.75,77.34 | D1.18 261.49,74.93 v261.75,74.68 | D1.17 v261.37,72.39 | D1.16 261.62,69.85 v261.75,69.72 | D1.15 261.62,67.31 v261.75,67.44 | D1.14 v261.75,64.77 | D1.13 261.62,62.23 v261.75,62.1 | D1.12 261.49,59.69 v261.75,59.44 | D1.11 v261.75,57.15 | D2.20 v260.99,41.91 | D2.19 260.86,39.37 v260.99,39.24 | D2.18 260.86,36.83 v260.99,36.96 | D2.17 v261.37,34.29 | D2.16 261.11,31.75 v261.37,32 | D2.15 261.11,29.21 v261.37,28.96 | D2.14 v261.37,26.67 | D2.13 261.24,24.13 v261.37,24 | D2.12 261.49,21.59 v261.75,21.34 | D2.11 v261.75,19.05
  pour Route2: -2.54,154.94 307.34,154.94 307.34,-2.54 -2.54,-2.54
LIGHTS  (via drill 0.35)
  Top 0.254: 46.35,130.81 46.99,131.44 S4.1 | R5.1 46.35,130.81 | v99.06,94.61 89.53,94.61 88.9,95.25 88.9,116.84 74.93,130.81 46.35,130.81 | v111.76,87.63 118.91,87.63 U1.P2_30
  Bottom 0.254: v99.06,94.61 104.78,94.61 v111.76,87.63
MAP_MODE  (via drill 0.35)
  Top 0.254: R18.1 298.67,99.53 | S15.1 299.94,103.34 299.94,100.8 298.67,99.53 | 298.67,99.53 295.05,95.91 285.85,95.91 285.82,95.89 212.72,95.89 194.94,113.67 v191.77,113.67
  Bottom 0.254: v191.77,113.67 172.09,93.98 134.62,93.98 127.95,87.31 127.95,84.34 126.81,83.19 U1.P2_25
N$1
  Top 0.254: U$3.P$21 230.5,31.11 244.47,31.11 D2.3
N$2
  Top 0.254: U$3.P$22 230.5,28.57 244.47,28.57 D2.4
N$3
  Top 0.254: D2.10 243.84,12.7 U$3.P$28
N$4
  Top 0.254: U$3.P$27 230.5,15.88 244.47,15.88 D2.9
N$5
  Top 0.254: U$3.P$26 230.5,18.41 244.47,18.41 D2.8
N$6
  Top 0.254: U$3.P$25 230.5,20.95 244.47,20.95 D2.7
N$7
  Top 0.254: U$3.P$24 230.5,23.5 244.47,23.5 D2.6
N$8
  Top 0.254: U$3.P$23 243.84,25.4 D2.5
N$9
  Top 0.254: U$3.P$1 220.98,46.99 220.98,47.62 221.62,48.26 241.3,48.26 D2.2
N$10
  Top 0.254: U$1.P$21 234.31,74.93 D1.3
N$11
  Top 0.254: LCD1.3 104.14,94.61 86.36,76.83 75.56,76.83 73.66,78.74 R23.S
N$12
  Top 0.254: U$1.P$24 234.31,67.31 D1.6
N$13
  Top 0.254: U$1.P$25 234.31,64.77 D1.7
N$14
  Top 0.254: U$1.P$26 234.31,62.23 D1.8
N$15
  Top 0.254: U$1.P$27 234.31,59.69 D1.9
N$20
  Top 0.254: U$1.P$28 234.31,57.15 D1.10
N$21
  Top 0.254: U$1.P$1 221.62,86.36 221.62,87.63 222.25,88.27 245.11,88.27 247.01,86.36 247.01,78.74 248.28,77.47 D1.2
N$22
  Top 0.254: U$1.P$2 220.98,83.19 219.71,84.45 219.71,87 222.25,89.53 246.38,89.53 250.19,85.72 D1.1
N$23
  Top 0.254: D2.1 243.21,48.9 219.71,48.9 219.07,48.26 219.07,46.99 220.34,45.72 220.34,44.45 221.62,43.18 U$3.P$2
N$26
  Top 0.254: C1.2 29.23,5.69 24.51,10.41 R24.2
N$28
  Top 0.254: U$1.P$23 234.31,69.85 D1.5
N$29
  Top 0.254: U$1.P$22 234.31,72.39 D1.4
RCS_TOGGLE  (via drill 0.35)
  Top 0.254: R16.1 251.93,101.6 | 251.93,101.6 251.93,103.67 S8.1 | 251.93,101.6 247.49,97.16 214,97.16 194.94,116.2 193.41,116.2 193.33,116.13 192.75,116.13 192.67,116.2 v191.77,116.2
  Bottom 0.254: v191.77,116.2 170.81,95.25 133.09,95.25 123.12,85.28 123.12,83.67 U1.P2_29
REF_MINUS  (6 unrouted)
  Top 0.254: U1.P1_17 136.97,16.7 137.16,16.51 | 137.16,16.51 134.62,13.97 JP2.1 | 137.16,16.51 143.51,10.16 JP1.1
  Bottom 0.254: JP1.1 170.18,6.99 192.41,6.99 204.43,19.01 R1.CW 220.24,94.55 R2.A3 287,95.14 287,96.66 291.81,101.47 291.81,122.94 R3.CW | 164.47,27.94 U2.V3
REF_PLUS  (via drill 0.35)  (4 unrouted)
  Top 0.254: U1.P1_18 136.97,65.84 140.34,69.22 166.37,69.22 167.88,67.7 169.24,67.7 169.48,67.94 188.63,67.94 | 188.63,67.94 R1.CCW 199.43,98.39 v199.39,98.42 | R3.CCW 285.15,121.28 v203.84,121.28 | R2.A1 283.31,10.16 279.4,10.16 276.23,6.99 183.51,6.99 | 183.51,6.99 JP1.5 180.34,13.97 188.59,22.23 v188.59,51.44 | 183.51,6.99 183.51,5.71 181.61,3.81 118.75,3.81 118.11,4.45 116.2,4.45 107.95,12.7 JP2.5 | v188.59,62.87 188.59,67.91 188.63,67.94
  Bottom 0.254: v199.39,98.42 199.39,116.84 v203.84,121.28 | v188.59,51.44 v188.59,62.87
RS
  Top 0.254: LCD1.4 106.68,96.52 114.3,88.9 122.56,88.9 124.27,87.19 U1.P2_28
SAS_POT  (via drill 0.35)
  Top 0.254: R3.S 290.83,123.19 285.88,118.24 176.02,118.24 v175.26,117.47
  Bottom 0.254: v175.26,117.47 101.6,117.47 97.16,113.03 97.16,93.98 106.33,84.81 U1.P2_36
SAS_TOGGLE  (via drill 0.35)
  Top 0.254: R15.1 226.06,100.8 226.06,101.6 | 226.06,101.6 S7.1 | 226.06,101.6 222.25,97.79 214.63,97.79 195.58,116.84 v193.04,116.84
  Bottom 0.254: v193.04,116.84 192.14,116.84 192.06,116.91 191.48,116.91 170.45,95.89 131.18,95.89 120.58,85.28 120.58,83.67 U1.P2_31
SCLB  (via drill 0.35)
  Top 0.254: U$3.P$12 215.9,17.78 v196.85,36.83
  Bottom 0.254: v196.85,36.83 196.85,72.39 193.68,75.56 149.22,75.56 147.12,77.67 U1.P2_09
SCLO  (via drill 0.35)
  Top 0.254: U$1.P$12 v184.78,57.78 | v150.11,73.53 v136.02,73.53
  Bottom 0.254: v184.78,57.78 177.8,64.77 177.8,73.03 177.16,73.66 150.24,73.66 v150.11,73.53 | U1.P1_28 124.27,59.44 124.27,60.13 124.27,61.78 v136.02,73.53
SDAB  (via drill 0.35)
  Top 0.254: U$3.P$13 215.26,15.24 v196.85,33.66
  Bottom 0.254: v196.85,33.66 194.94,35.56 194.94,73.03 193.04,74.93 148.59,74.93 144.59,78.94 U1.P2_11
SDAO  (via drill 0.35)
  Top 0.254: U$1.P$13 v185.42,55.24
  Bottom 0.254: v185.42,55.24 177.16,63.5 177.16,71.75 176.53,72.39 149.69,72.39 142.68,79.4 142.68,81.29 143.19,81.8 143.19,82.74 142.52,83.41 141.57,83.41 140.9,82.74 140.9,81.8 141.35,81.35 141.35,76.62 141.41,76.56 126.81,61.95 U1.P1_26
SELLJOY  (1 unrouted)
  Top 0.254: 109.86,42.93 U3.B1A
SELRJOY  (1 unrouted)
STAGE  (via drill 0.3 pad 0.61)
  Top 0.254: R14.1 241.77,129.54 | 241.77,129.54 S1.1 | 241.77,129.54 236.82,124.59 211.07,124.59 195.07,140.59 162.31,140.59 139.06,117.35 v139.06,115.44
  Bottom 0.254: U1.P2_34 128.35,96.52 139.06,96.52 v139.06,115.44
THROTTLE  (via drill 0.35)
  Top 0.254: v209.55,18.41 191.13,36.83 191.13,53.98 162.72,53.98 U1.P1_02
  Bottom 0.254: R2.A2 282.67,4.54 281.31,3.17 275.59,3.17 271.14,7.62 214.63,7.62 213.36,8.89 213.36,14.61 v209.55,18.41
TIME_FAST  (via drill 0.35)
  Top 0.254: R22.2 53.98,6.35 49.53,10.79 49.53,20.32 | 49.53,20.32 52.03,22.82 SW4.1 | 49.53,20.32 49.53,25.4 62.23,38.1 93.98,38.1 95.25,39.37 95.25,43.18 98.42,46.35 113.03,46.35 120.58,53.91 120.58,59.88 120.65,59.95 120.65,60.96 121.28,61.59 v135.25,61.59
  Bottom 0.254: v135.25,61.59 142.4,61.59 U1.P1_12
TIME_SLOW  (via drill 0.35)
  Top 0.254: R21.2 32.38,6.35 27.3,11.43 27.3,20.95 | 27.3,20.95 29.17,22.82 SW3.1 | 27.3,20.95 27.3,26.67 29.21,28.57 50.8,28.57 v63.5,41.27
  Bottom 0.254: v63.5,41.27 70.48,48.26 118.75,48.26 121.72,51.24 U1.P1_29
TIME_STOP  (via drill 0.35)
  Top 0.254: R20.2 10.16,6.35 4.45,12.06 4.45,20.82 4.51,20.89 | 4.51,20.89 SW2.1 | 4.51,20.89 4.51,28.01 6.99,30.48 50.8,30.48 v59.05,38.73
  Bottom 0.254: v59.05,38.73 69.22,48.9 117.47,48.9 120.65,52.07 120.65,56.33 120.58,56.4 120.58,57.34 121.25,58.01 153.35,58.01 U1.P1_04
VDD_3P3V  (via drill 0.3 pad 0.61)
  Top 0.254: R19.1 v172.09,129.54 D3.ANODE | R13.2 v41.27,41.91 | R12.2 v8.89,43.18 | R10.2 v8.89,66.04 | R8.2 v8.89,91.44 | R6.2 v8.89,111.76 | R4.2 v8.26,133.35 | R5.2 v40.01,130.81 | R7.2 v40.01,110.49 | R9.2 v40.01,90.17 | R11.2 v40.01,64.77 | R20.1 v16.51,6.35 | R21.1 v40.01,6.35 | R22.1 v61.85,6.35 | R14.2 v248.28,132.08 | D4.ANODE v230.5,144.78 | R17.2 v282.57,99.06 | v301.37,97.79 301.37,96.52 300.74,95.89 R18.2 | R16.2 v255.91,99.06 | R15.2 v231.78,99.06 | v142.24,67.94 142.04,67.94 U1.P1_14 | U1.P2_23 129.54,82.08 v129.54,74.3
  pour Route15: -5.08,157.48 309.88,157.48 309.88,-5.08 -5.08,-5.08
VDD_5V
  Route15 2.54: 135.89,106.68 134.62,105.41 LCD1.15 | 135.89,106.68 141.6,106.68 144.15,109.22 184.78,109.22 198.75,95.25 210.19,95.25 214,91.44 214,65.41 | 135.89,106.68 103.5,106.68 | 103.5,106.68 101.6,104.78 LCD1.2 | U$3.P$9 218.44,25.4 214,29.84 214,65.41 | 103.5,106.68 67.94,106.68 61.59,100.33 61.59,88.39 62.78,88.39 R23.CCW 71.16,76.41 73.91,73.66 94.61,73.66 97.47,70.8 136.84,70.8 | 214,65.41 U$1.P$9 | U1.P2_13 142.04,73.22 142.24,73.03 140.02,70.8 136.84,70.8 | U1.P1_24 129.54,59.6 129.54,63.5 136.84,70.8
  Bottom 0.508: U1.P2_13 142.04,72.19 142.04,72.11 U1.P1_24
XLJOY  (1 unrouted)
  Bottom 0.254: JP2.4 110.49,11.43 112.39,9.53 133.35,9.53 134.62,10.79 134.62,37.47 129.34,42.74 U1.P1_23
XRJOY  (1 unrouted)
  Bottom 0.254: JP1.4 174.62,13.34 145.41,13.34 137.79,20.95 137.79,39.37 134.43,42.74 U1.P1_19
YLJOY  (1 unrouted)
  Bottom 0.254: JP2.3 113.03,12.06 114.3,10.79 130.81,10.79 132.72,12.7 132.72,36.83 126.81,42.74 U1.P1_25
YRJOY  (2 unrouted)
  Top 0.254: 184.53,23.13 184.53,23.24
  Bottom 0.254: JP1.3 173.35,12.06 144.78,12.06 135.89,20.95 135.89,38.73 131.44,43.18 131.44,56.43 U1.P1_21

### Text on the board
tPlace: Vcc | Sel | GND | Xout | Yout | PocketKerbal / Version 1.0 / RN3
bDocu: https://github.com/rafeisme/ENGI301